# EAGLE schematic CAN-D Rev1 (EAGLE 9.3.0)
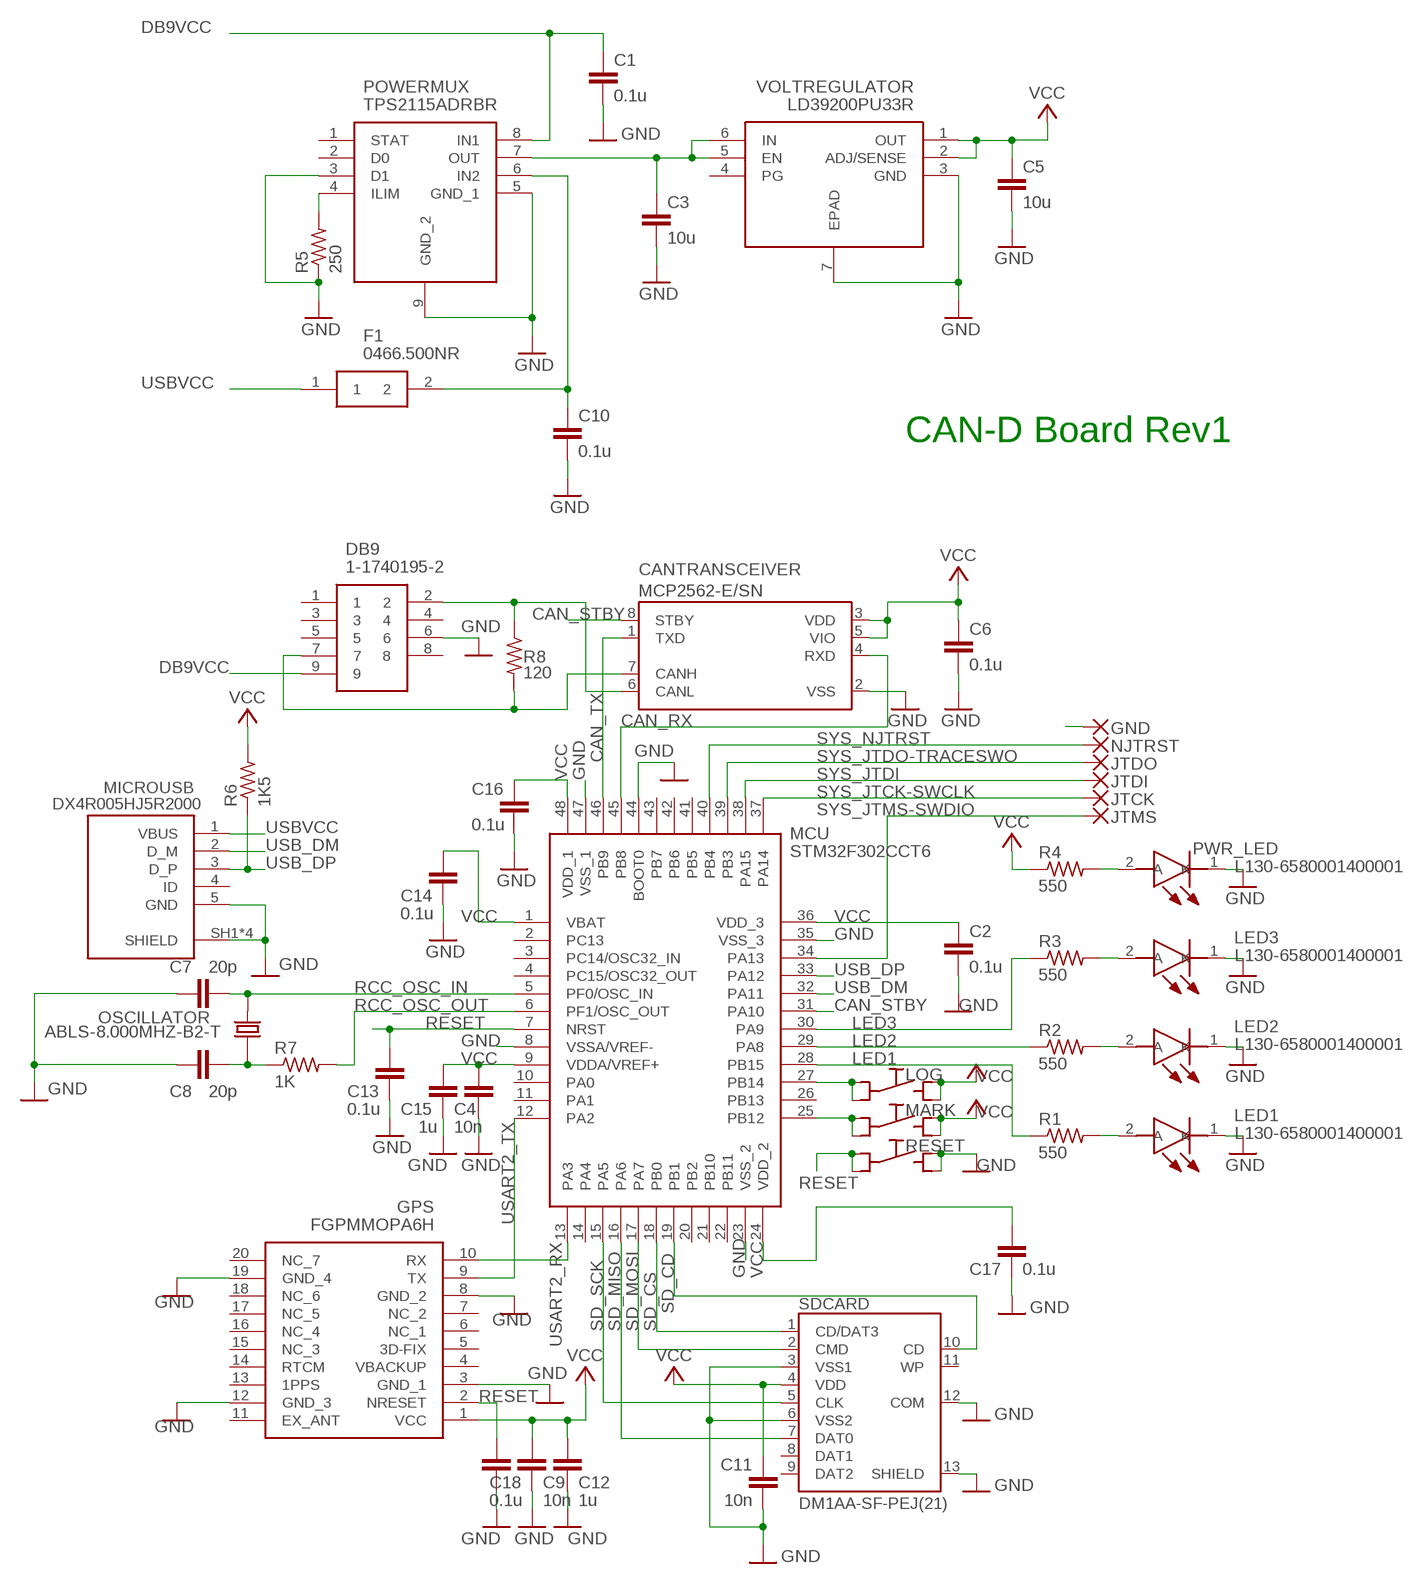
[diagram p0: schematic, sheet 1]

## Parts
C1  0.1u  C-EUC0603  [C0603]
C2  0.1u  C-EUC0603  [C0603]
C3  10u  C-EUC0603  [C0603]
C4  10n  C-EUC0603  [C0603]
C5  10u  C-EUC0603  [C0603]
C6  0.1u  C-EUC0603  [C0603]
C7  20p  C-EUC0603  [C0603]
C8  20p  C-EUC0603  [C0603]
C9  10n  C-EUC0603  [C0603]
C10  0.1u  C-EUC0603  [C0603]
C11  10n  C-EUC0603  [C0603]
C12  1u  C-EUC0603  [C0603]
C13  0.1u  C-EUC0603  [C0603]
C14  0.1u  C-EUC0603  [C0603]
C15  1u  C-EUC0603  [C0603]
C16  0.1u  C-EUC0603  [C0603]
C17  0.1u  C-EUC0603  [C0603]
C18  0.1u  C-EUC0603  [C0603]
CANTRANSCEIVER  MCP2562-E/SN  [SOIC127P600X175-8N]
DB9  1-1740195-2  [1-1740195-2]
F1  0466.500NR  [FUSC3215X58N]
GND  2,54/1,1  [2,54/1,1]
GPS  FGPMMOPA6H  [FGPMMOPA6H]
JTCK  2,54/1,1  [2,54/1,1]
JTDI  2,54/1,1  [2,54/1,1]
JTDO  2,54/1,1  [2,54/1,1]
JTMS  2,54/1,1  [2,54/1,1]
LED1  L130-6580001400001  [L130-6580001400001]
LED2  L130-6580001400001  [L130-6580001400001]
LED3  L130-6580001400001  [L130-6580001400001]
LOG  SCHURTER-LSH-1301.9314  [LSH]
MARK  SCHURTER-LSH-1301.9314  [LSH]
MCU  STM32F302CCT6  [QFP50P900X900X160-48N]
MICROUSB  DX4R005HJ5R2000  [JAE_DX4R005HJ5R2000]
NJTRST  2,54/1,1  [2,54/1,1]
OSCILLATOR  ABLS-8.000MHZ-B2-T  [XTAL_ABLS-8.000MHZ-B2-T]
POWERMUX  TPS2115ADRBR  [SON65P300X300X100-9N]
PWR_LED  L130-6580001400001  [L130-6580001400001]
R1  550  R-US_R0603  [R0603]
R2  550  R-US_R0603  [R0603]
R3  550  R-US_R0603  [R0603]
R4  550  R-US_R0603  [R0603]
R5  250  R-US_R0603  [R0603]
R6  1K5  R-US_R0603  [R0603]
R7  1K  R-US_R0603  [R0603]
R8  120  R-US_R0603  [R0603]
RESET  SCHURTER-LSH-1301.9314  [LSH]
SDCARD  DM1AA-SF-PEJ(21)  [HRS_DM1AA-SF-PEJ(21)]
VOLTREGULATOR  LD39200PU33R  [SON95P300X300X100-7N]

## Nets
CAN_RX: CANTRANSCEIVER.4(RXD) MCU.45(PB8)
CAN_STBY: CANTRANSCEIVER.8(STBY) MCU.31(PA10)
CAN_TX: CANTRANSCEIVER.1(TXD) MCU.46(PB9)
DB9VCC: C1.1 DB9.9 POWERMUX.8(IN1)
GND: C1.2 C2.2 C3.2 C4.2 C5.2 C6.2 C7.2 C8.2 C9.2 C10.2 C11.2 C12.2 C13.2 C14.2 C15.2 C16.2 C17.2 C18.2 CANTRANSCEIVER.2(VSS) DB9.6 GND.1(P) GPS.3(GND_1) GPS.8(GND_2) GPS.12(GND_3) GPS.19(GND_4) LED1.1(K) LED2.1(K) LED3.1(K) MCU.8(VSSA/VREF-) MCU.23(VSS_2) MCU.35(VSS_3) MCU.44(BOOT0) MCU.47(VSS_1) MICROUSB.5(GND) MICROUSB.SH1(SHIELD) MICROUSB.SH2(SHIELD) MICROUSB.SH3(SHIELD) MICROUSB.SH4(SHIELD) POWERMUX.3(D1) POWERMUX.5(GND_1) POWERMUX.9(GND_2) PWR_LED.1(K) R5.1 RESET.NO1(NO) RESET.NO2(NO) SDCARD.3(VSS1) SDCARD.6(VSS2) SDCARD.12(COM) SDCARD.13(SHIELD) VOLTREGULATOR.3(GND) VOLTREGULATOR.7(EPAD)
LED1: MCU.28(PB15) R1.1
LED2: MCU.29(PA8) R2.1
LED3: MCU.30(PA9) R3.1
N$1: C3.1 POWERMUX.7(OUT) VOLTREGULATOR.5(EN) VOLTREGULATOR.6(IN)
N$2: CANTRANSCEIVER.7(CANH) DB9.7 R8.2
N$3: LED1.2(A) R1.2
N$4: LED2.2(A) R2.2
N$5: LED3.2(A) R3.2
N$6: PWR_LED.2(A) R4.2
N$7: CANTRANSCEIVER.6(CANL) DB9.2 R8.1
N$8: POWERMUX.4(ILIM) R5.2
N$9: C10.1 F1.2 POWERMUX.6(IN2)
N$10: C8.1 OSCILLATOR.1 R7.1
N$11: MARK.C1(C) MARK.C2(C) MCU.25(PB12)
N$19: LOG.C1(C) LOG.C2(C) MCU.27(PB14)
RCC_OSC_IN: C7.1 MCU.5(PF0/OSC_IN) OSCILLATOR.2
RCC_OSC_OUT: MCU.6(PF1/OSC_OUT) R7.2
RESET: C13.1 C18.1 GPS.2(NRESET) MCU.7(NRST) RESET.C1(C) RESET.C2(C)
SD_CD: MCU.19(PB1) SDCARD.10(CD)
SD_CS: MCU.18(PB0) SDCARD.1(CD/DAT3)
SD_MISO: MCU.16(PA6) SDCARD.7(DAT0)
SD_MOSI: MCU.17(PA7) SDCARD.2(CMD)
SD_SCK: MCU.15(PA5) SDCARD.5(CLK)
SYS_JTCK-SWCLK: JTCK.1(P) MCU.37(PA14)
SYS_JTDI: JTDI.1(P) MCU.38(PA15)
SYS_JTDO-TRACESWO: JTDO.1(P) MCU.39(PB3)
SYS_JTMS-SWDIO: JTMS.1(P) MCU.34(PA13)
SYS_NJTRST: MCU.40(PB4) NJTRST.1(P)
USART2_RX: GPS.10(RX) MCU.13(PA3)
USART2_TX: GPS.9(TX) MCU.12(PA2)
USB_DM: MCU.32(PA11) MICROUSB.2(D_M)
USB_DP: MCU.33(PA12) MICROUSB.3(D_P) R6.1
USBVCC: F1.1 MICROUSB.1(VBUS)
VCC: C2.1 C4.1 C5.1 C6.1 C9.1 C11.1 C12.1 C14.1 C15.1 C16.1 C17.1 CANTRANSCEIVER.3(VDD) CANTRANSCEIVER.5(VIO) GPS.1(VCC) LOG.NO1(NO) LOG.NO2(NO) MARK.NO1(NO) MARK.NO2(NO) MCU.1(VBAT) MCU.9(VDDA/VREF+) MCU.24(VDD_2) MCU.36(VDD_3) MCU.48(VDD_1) R4.1 R6.2 SDCARD.4(VDD) VOLTREGULATOR.1(OUT) VOLTREGULATOR.2(ADJ/SENSE)
Unconnected: DB9.1 DB9.3 DB9.4 DB9.5 DB9.8 GPS.4(VBACKUP) GPS.5(3D-FIX) GPS.6(NC_1) GPS.7(NC_2) GPS.11(EX_ANT) GPS.13(1PPS) GPS.14(RTCM) GPS.15(NC_3) GPS.16(NC_4) GPS.17(NC_5) GPS.18(NC_6) GPS.20(NC_7) MCU.2(PC13) MCU.3(PC14/OSC32_IN) MCU.4(PC15/OSC32_OUT) MCU.10(PA0) MCU.11(PA1) MCU.14(PA4) MCU.20(PB2) MCU.21(PB10) MCU.22(PB11) MCU.26(PB13) MCU.41(PB5) MCU.42(PB6) MCU.43(PB7) MICROUSB.4(ID) POWERMUX.1(STAT) POWERMUX.2(D0) SDCARD.8(DAT1) SDCARD.9(DAT2) SDCARD.11(WP) VOLTREGULATOR.4(PG)

## Notes on the sheet
- CAN-D Board Rev1

## Library data of the parts
C1-C18 = rcl:C-EU: CAPACITOR, European symbol; SPICEPREFIX: C
CANTRANSCEIVER = MCP2562-E_SN:MCP2562-E/SN: MCP2562 Series 5 V Surface Mount High-Speed CAN Transceiver - SOIC-8; AVAILABILITY: Unavailable; DESCRIPTION: Microchip MCP2562-E/SN, CAN Transceiver 1MBps 1-channel IEC 61000-4-2, 8-Pin SOIC; MF: Microchip; MP: MCP2562-E/SN; PACKAGE: SO-8 Microchip; PRICE: None
DB9 = 1-1740195-2:1-1740195-2: 9 pos smt plug 4-40 threaded/inserts Source: Datasheet <http://www.te.com/commerce/DocumentDelivery/DDEController?Action=showdoc&DocId=Customer Drawing1740195EpdfEnglishENG_CD_1740195_E.pdf1-1740195-2>; ALLIED_NUMBER: 70287697; ALLIED_PRICE-STOCK: http://www.alliedelec.com/te-connectivity-1-1740195-2/70287697/; DESCRIPTION: 9 pos smt plug 4-40 threaded/inserts; HEIGHT: mm; MANUFACTURER_NAME: TE Connectivity; MANUFACTURER_PART_NUMBER: 1-1740195-2; MOUSER_PART_NUMBER: 571-1-1740195-2; MOUSER_PRICE-STOCK: https://www.mouser.com/Search/Refine.aspx?Keyword=571-1-1740195-2; RS_PART_NUMBER: 5269513P; RS_PRICE-STOCK: http://uk.rs-online.com/web/p/products/5269513P
F1 = 0466.500NR:0466.500NR: SlimLine Lead-Free 1206 surface mount fuse Source: Datasheet <http://docs-emea.rs-online.com/webdocs/0785/0900766b80785544.pdf>; DESCRIPTION: SlimLine Lead-Free 1206 surface mount fuse; HEIGHT: 0.58mm; MANUFACTURER_NAME: LITTELFUSE; MANUFACTURER_PART_NUMBER: 0466.500NR; MOUSER_PART_NUMBER: 576-0466.500NR; MOUSER_PRICE-STOCK: https://www.mouser.com/Search/Refine.aspx?Keyword=576-0466.500NR; RS_PART_NUMBER: 5413568; RS_PRICE-STOCK: http://uk.rs-online.com/web/p/products/5413568
GND JTCK JTDI JTDO JTMS NJTRST = wirepad:2,54/1,1: THROUGH-HOLE PAD
GPS = FGPMMOPA6H:FGPMMOPA6H: GPS Standalone Module, 20-pin Source: Datasheet <https://cdn-shop.adafruit.com/datasheets/GlobalTop-FGPMMOPA6H-Datasheet-V0A.pdf>; DESCRIPTION: GPS Standalone Module, 20-pin; HEIGHT: mm; MANUFACTURER_NAME: GlobalTop Technology Inc.; MANUFACTURER_PART_NUMBER: FGPMMOPA6H
LED1-LED3 PWR_LED = L130-6580001400001:L130-6580001400001: Lumileds L130-6580001400001, LUXEON 3014 Series White LED, 6500K, 3014, Rectangle Lens SMD Package Source: Datasheet <http://www.lumileds.com/uploads/459/DS208-pdf>; ALLIED_NUMBER: 70522463; ALLIED_PRICE-STOCK: http://www.alliedelec.com/lumileds-l130-6580001400001/70522463/; DESCRIPTION: Lumileds L130-6580001400001, LUXEON 3014 Series White LED, 6500K, 3014, Rectangle Lens SMD Package; HEIGHT: mm; MANUFACTURER_NAME: Lumileds; MANUFACTURER_PART_NUMBER: L130-6580001400001; MOUSER_PART_NUMBER: 997-L130-65800014001; MOUSER_PRICE-STOCK: https://www.mouser.com/Search/Refine.aspx?Keyword=997-L130-65800014001; RS_PART_NUMBER: 1709867; RS_PRICE-STOCK: http://uk.rs-online.com/web/p/products/1709867
LOG MARK RESET = schurter_switches_LSH_SMS:SCHURTER-LSH-*: Schurter LSH Printmount Switches, Gullwing Leads Momentary Action: Normally Open (NO) 6.0 x 6.0 mm Body Dim. Actuator Diam. mm / Overall Height mm / Schurter # -------------------------------------------------------------- 3.40 / 4.30 / 1301.9314.xx 3.40 / 4.30 / 1301.9315.xx 3.20 / 7.00 / 1301.9316.xx 3.30 / 7.30 / 1301.9317.xx 3.10 / 8.00 / 1301.9319.xx 3.00 / 12.5 / 1301.9320.xx xx: denotes packaging, see Schurter data sheets Author: Dipl.-Ing. FH Rainer Bayer Hochschule Heilbronn HHN: rainer.bayer@hs-heilbronn.de | http://mitarbeiter.hs-heilbronn.de/~rbayer/ Ingenieurbüro ing-rb: mail@ing-rb.de | http://www.ing-rb.de/
MCU = STM32F302CCT6:STM32F302CCT6: STM32F302CCT6 Source: Datasheet <http://www.st.com/web/en/resource/technical/document/datasheet/DM00094064.pdf>; ALLIED_NUMBER: 70520771; ALLIED_PRICE-STOCK: http://www.alliedelec.com/stmicroelectronics-stm32f302cct6/70520771/; HEIGHT: 1.6mm; MANUFACTURER_NAME: STMicroelectronics; MANUFACTURER_PART_NUMBER: STM32F302CCT6; MOUSER_PART_NUMBER: 511-STM32F302CCT6; MOUSER_PRICE-STOCK: https://www.mouser.com/Search/Refine.aspx?Keyword=511-STM32F302CCT6; RS_PART_NUMBER: 1656736; RS_PRICE-STOCK: http://uk.rs-online.com/web/p/products/1656736
MICROUSB = DX4R005HJ5R2000:DX4R005HJ5R2000: RCPT MICRO USB 2.0 B SMT H/D; DESCRIPTION: DX4 series, receptacle, on-board, right-angle standard mount, surface mount; DIGI-KEY_PART_NUMBER: 670-2674-1-ND; DIGI-KEY_PURCHASE_URL: https://www.digikey.ca/product-detail/en/jae-electronics/DX4R005HJ5R2000/670-2674-1-ND/3903234?utm_source=snapeda&utm_medium=aggregator&utm_campaign=symbol; MF: JAE Electronics; MP: DX4R005HJ5R2000; PACKAGE: None
OSCILLATOR = ABLS-8.000MHZ-B2-T:ABLS-8.000MHZ-B2-T: Crystal 8MHz Â±20ppm (Tol) Â±50ppm (Stability) 18pF FUND 80Ohm 2-Pin HC-49/US SMD T/R; AVAILABILITY: Unavailable; DESCRIPTION: Crystal 8MHz Â±20ppm _Tol_ Â±50ppm _Stability_ 18pF FUND 80Ohm 2-Pin HC-49/US SMD T/R; MF: Abracon LLC; MP: ABLS-8.000MHZ-B2-T; PACKAGE: HC49/US Abracon; PRICE: None
POWERMUX = TPS2115ADRBR:TPS2115ADRBR: Autoswitching Power Mux Source: Datasheet <http://www.ti.com/lit/gpn/tps2115a>; DESCRIPTION: Autoswitching Power Mux; HEIGHT: 1mm; MANUFACTURER_NAME: Texas Instruments; MANUFACTURER_PART_NUMBER: TPS2115ADRBR; MOUSER_PART_NUMBER: 595-TPS2115ADRBR; MOUSER_PRICE-STOCK: https://www.mouser.com/Search/Refine.aspx?Keyword=595-TPS2115ADRBR
R1-R8 = rcl:R-US_: RESISTOR, American symbol; SPICEPREFIX: R
SDCARD = DM1AA-SF-PEJ_21_:DM1AA-SF-PEJ(21): DM1 Series 12 (9+3) Position 2.90 mm Pitch SMT Right Angle PC Card Connector; DESCRIPTION: DM1 Series 12 _9+3_ Position 2.90 mm Pitch SMT Right Angle PC Card Connector; DIGI-KEY_PART_NUMBER: HR845CT-ND; DIGI-KEY_PURCHASE_URL: https://www.digikey.ca/product-detail/en/hirose-electric-co-ltd/DM1AA-SF-PEJ_21_/HR845CT-ND/559985?utm_source=snapeda&utm_medium=aggregator&utm_campaign=symbol; MF: Hirose; MP: DM1AA-SF-PEJ_21_; PACKAGE: None
VOLTREGULATOR = LD39200PU33R:LD39200PU33R: LDO Voltage Regulators 2 A high PSRR ultra low drop linear regulator with reverse current protection Source: Datasheet <https://www.st.com/resource/en/datasheet/ld39200.pdf>; DESCRIPTION: LDO Voltage Regulators 2 A high PSRR ultra low drop linear regulator with reverse current protection; HEIGHT: 1mm; MANUFACTURER_NAME: STMicroelectronics; MANUFACTURER_PART_NUMBER: LD39200PU33R; MOUSER_PART_NUMBER: 511-LD39200PU33R; MOUSER_PRICE-STOCK: https://www.mouser.com/Search/Refine.aspx?Keyword=511-LD39200PU33R